# Altium schematic sheet Power+ICs.SchDoc
size 558 x 431 mm; SheetNumber: 1; SheetTotal: 1; ENG_APP_DATE: --/--/--; DSN_APP_DATE: --/--/--; CHK_APP_DATE: --/--/--
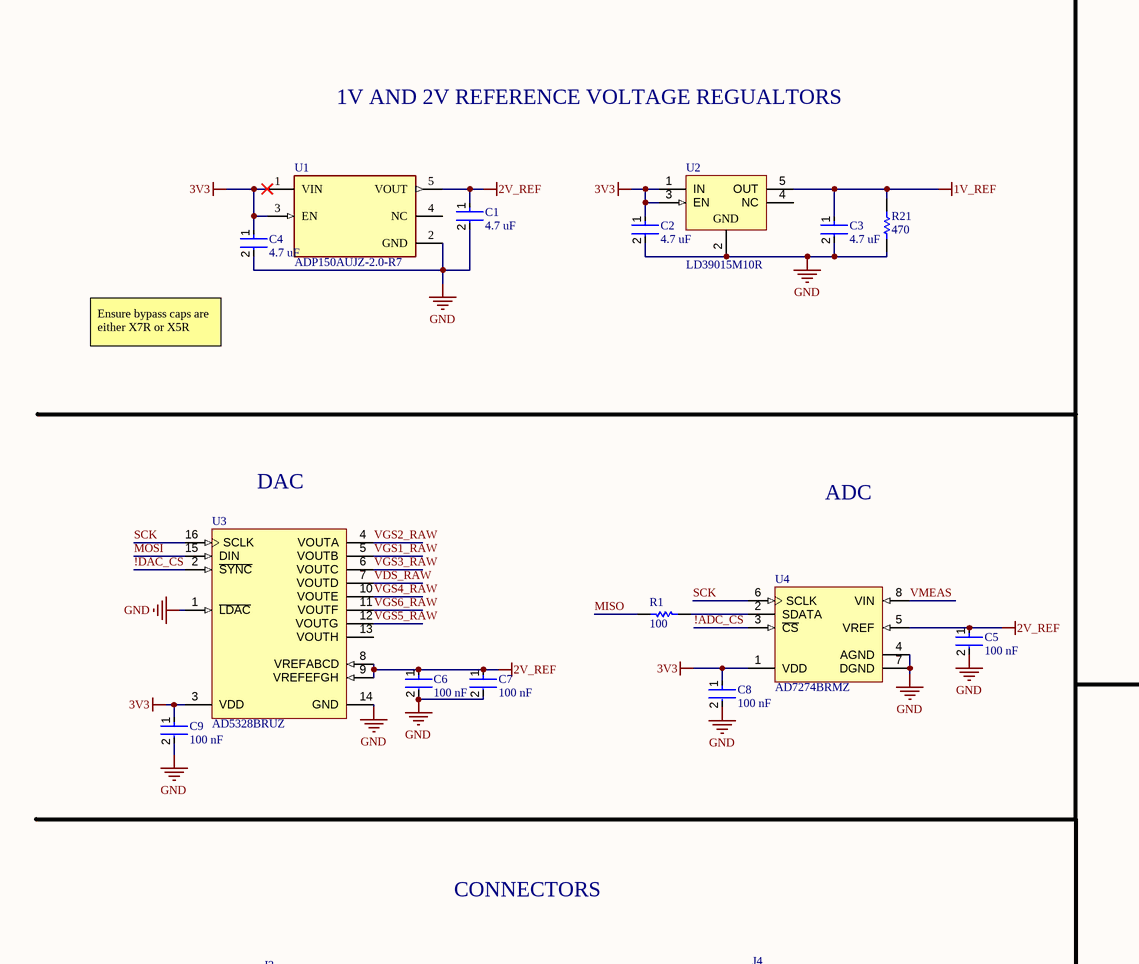
[diagram p0: Power+ICs.SchDoc, top left]
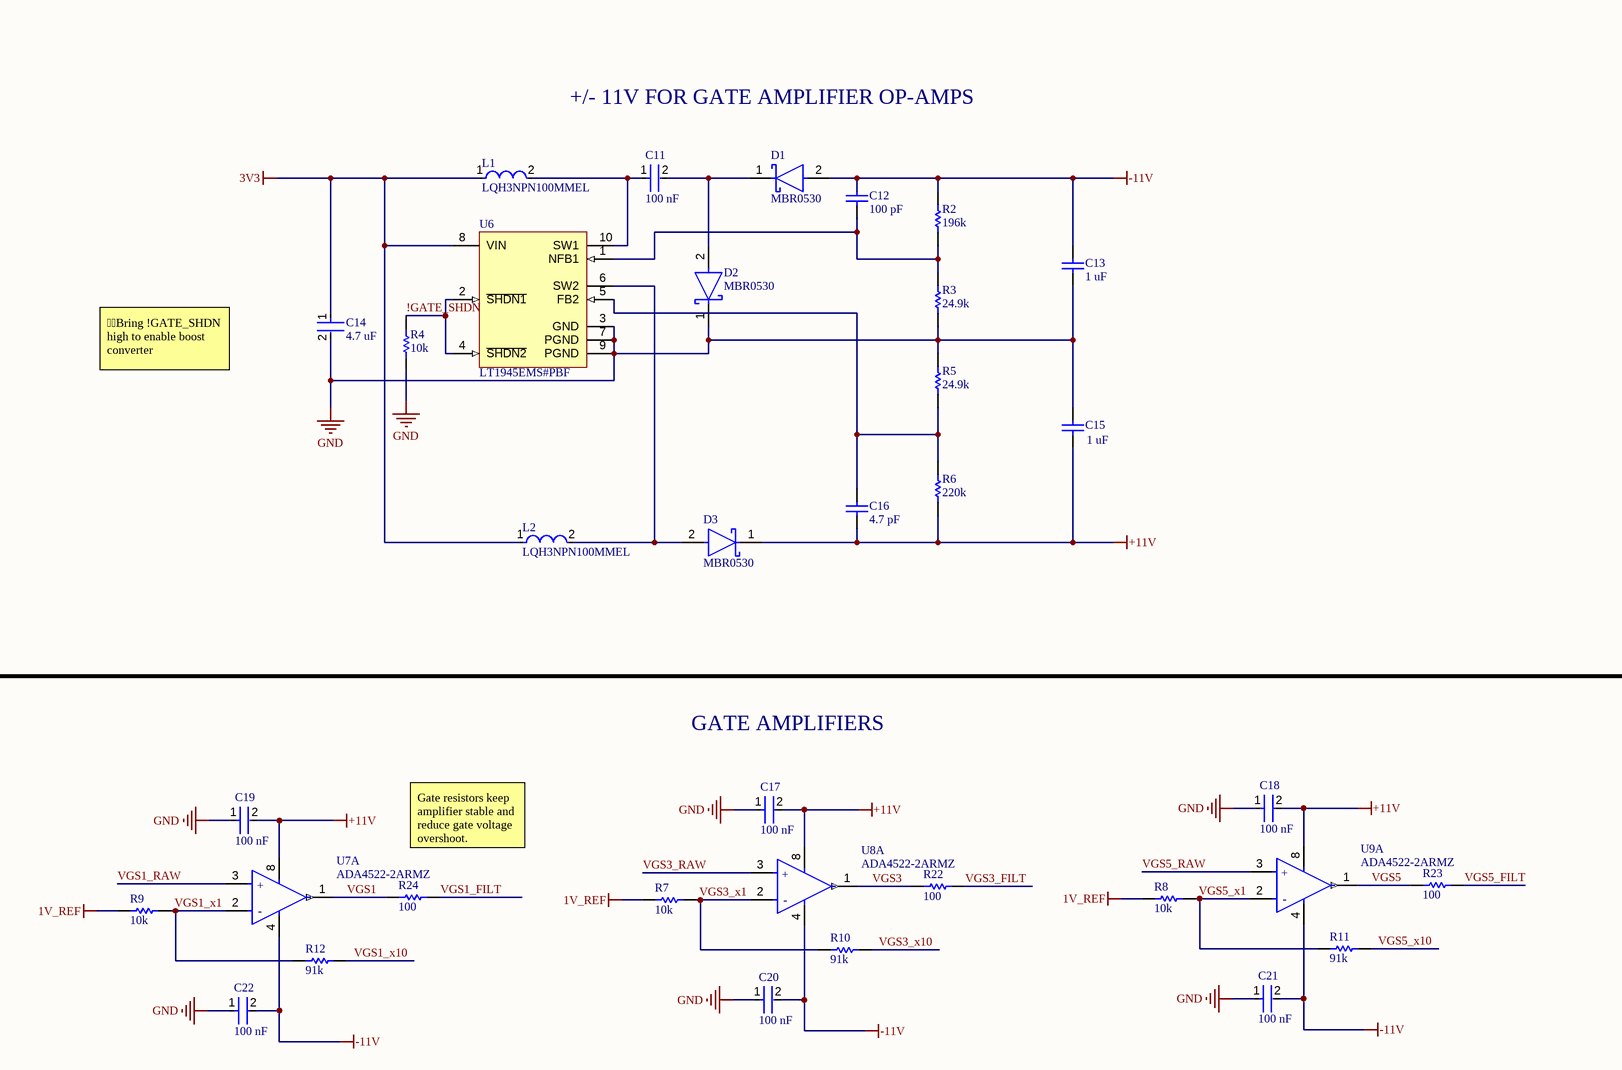
[diagram p1: Power+ICs.SchDoc, top right]
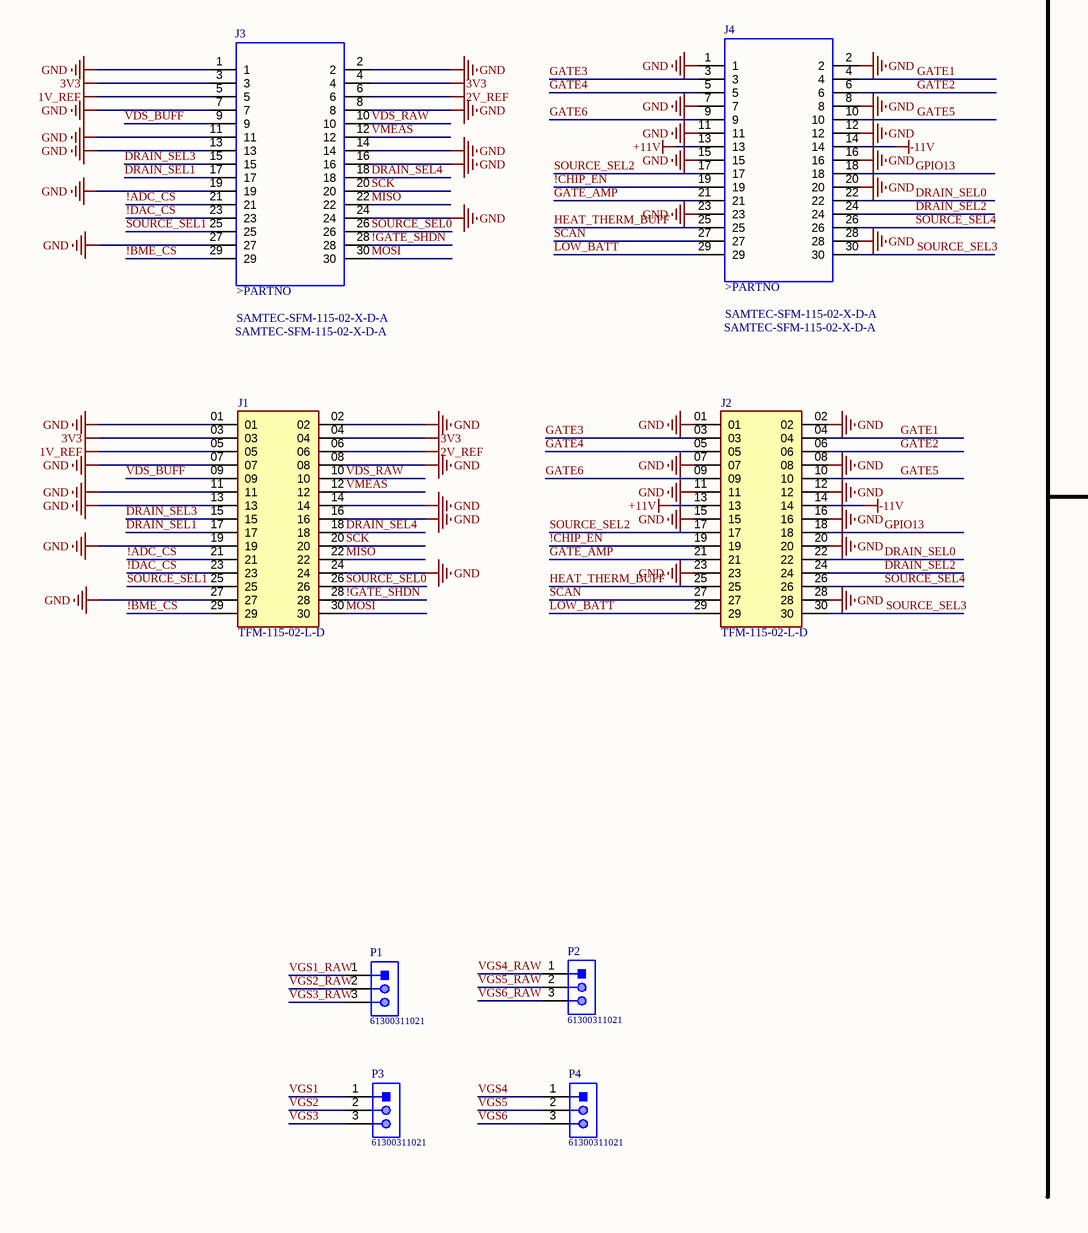
[diagram p2: Power+ICs.SchDoc, bottom left]
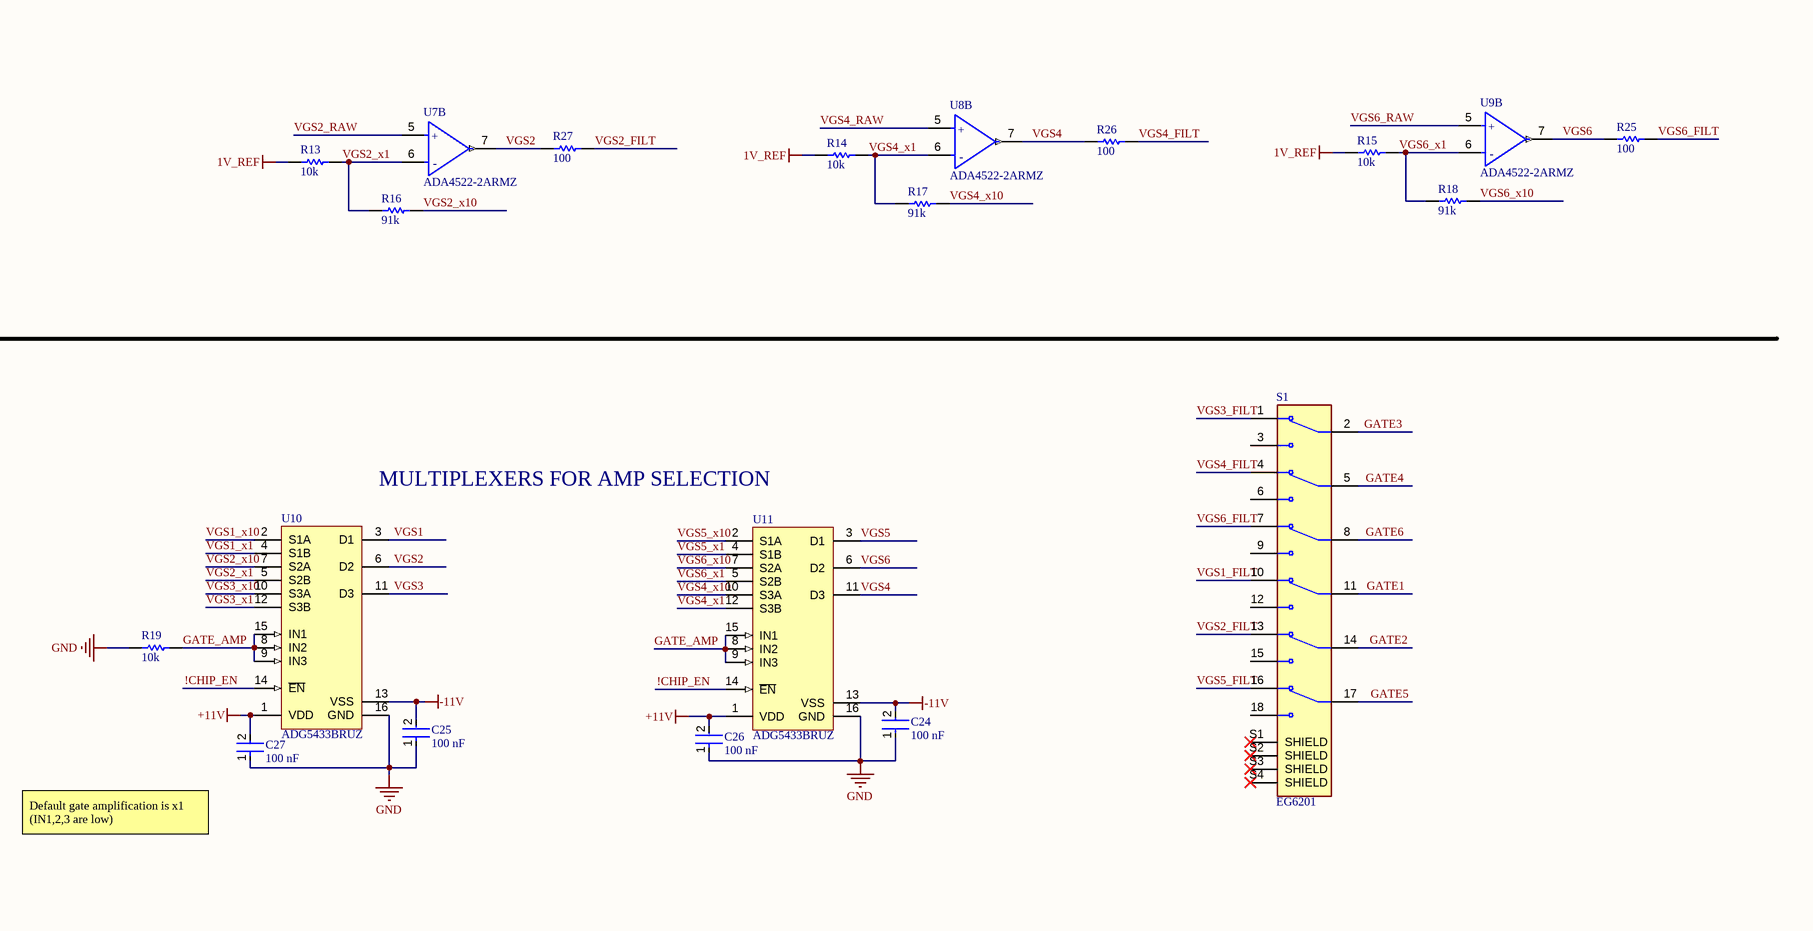
[diagram p3: Power+ICs.SchDoc, bottom right]

## Parts
C1  4.7 uF  [FP-C0805C475K3PACTU-MFG]
C2  4.7 uF  [FP-C0805C475K3PACTU-MFG]
C3  4.7 uF  [FP-C0805C475K3PACTU-MFG]
C4  4.7 uF  [FP-C0805C475K3PACTU-MFG]
C5  100 nF  [FP-C0805C-DN-MFG]
C6  100 nF  [FP-C0805C-DN-MFG]
C7  100 nF  [FP-C0805C-DN-MFG]
C8  100 nF  [FP-C0805C-DN-MFG]
C9  100 nF  [FP-C0805C-DN-MFG]
C11  100 nF  [FP-C0805C-DN-MFG]
C12  100 pF  [CAPC2013X140X50ML20T25]
C13  1 uF  [CAPC3216X110X50LL20T25]
C14  4.7 uF  [FP-C0805C475K3PACTU-MFG]
C15  1 uF  [CAPC3216X110X50LL20T25]
C16  4.7 pF  [CAPC2013X71X50ML20T25]
C17  100 nF  [FP-C0805C-DN-MFG]
C18  100 nF  [FP-C0805C-DN-MFG]
C19  100 nF  [FP-C0805C-DN-MFG]
C20  100 nF  [FP-C0805C-DN-MFG]
C21  100 nF  [FP-C0805C-DN-MFG]
C22  100 nF  [FP-C0805C-DN-MFG]
C24  100 nF  [FP-C0805C-DN-MFG]
C25  100 nF  [FP-C0805C-DN-MFG]
C26  100 nF  [FP-C0805C-DN-MFG]
C27  100 nF  [FP-C0805C-DN-MFG]
D1  MBR0530  [FP-425-04-MFG]
D2  MBR0530  [FP-425-04-MFG]
D3  MBR0530  [FP-425-04-MFG]
J1  TFM-115-02-L-D  [SAMTEC_TFM-115-02-L-D]
J2  TFM-115-02-L-D  [SAMTEC_TFM-115-02-L-D]
J3  SAMTEC-SFM-115-02-X-D-A  [SAMTEC-SFM-115-02-X-D-A]
J4  SAMTEC-SFM-115-02-X-D-A  [SAMTEC-SFM-115-02-X-D-A]
L1  LQH3NPN100MMEL  [FP-LQH3NPH_ME-MFG]
L2  LQH3NPN100MMEL  [FP-LQH3NPH_ME-MFG]
P1  61300311021  [61300311021]
P2  61300311021  [61300311021]
P3  61300311021  [61300311021]
P4  61300311021  [61300311021]
R1  100  [RESC2013X50X30LL20T20]
R2  196k  [RESC2013X50X30LL20T20]
R3  24.9k  [RESC2013X70X40LL20T20]
R4  10k  [RESC2013X60X35NL10T20]
R5  24.9k  [RESC2013X70X40LL20T20]
R6  220k  [RESC2013X70X40ML20T20]
R7  10k  [RESC2013X60X35NL10T20]
R8  10k  [RESC2013X60X35NL10T20]
R9  10k  [RESC2013X60X35NL10T20]
R10  91k  [RESC2013X60X35ML10T20]
R11  91k  [RESC2013X60X35ML10T20]
R12  91k  [RESC2013X60X35ML10T20]
R13  10k  [RESC2013X60X35NL10T20]
R14  10k  [RESC2013X60X35NL10T20]
R15  10k  [RESC2013X60X35NL10T20]
R16  91k  [RESC2013X60X35ML10T20]
R17  91k  [RESC2013X60X35ML10T20]
R18  91k  [RESC2013X60X35ML10T20]
R19  10k  [RESC2013X60X35NL10T20]
R21  470  [RESC2013X70X40ML20T20]
R22  100  [RESC2013X50X30LL20T20]
R23  100  [RESC2013X50X30LL20T20]
R24  100  [RESC2013X50X30LL20T20]
R25  100  [RESC2013X50X30LL20T20]
R26  100  [RESC2013X50X30LL20T20]
R27  100  [RESC2013X50X30LL20T20]
S1  EG6201  [SW_EG6201]
U1  ADP150AUJZ-2.0-R7  [FP-UJ-5-IPC_B]
U2  LD39015M10R  [SOT23-5L_M]
U3  AD5328BRUZ  [RU-16_L]
U4  AD7274BRMZ  [RM-8_N]
U6  LT1945EMS#PBF  [LT-MS-10_N]
U7  ADA4522-2ARMZ  [FP-RM-8-IPC_C]  (parts A,B of 2)
U8  ADA4522-2ARMZ  [FP-RM-8-IPC_C]  (parts A,B of 2)
U9  ADA4522-2ARMZ  [FP-RM-8-IPC_C]  (parts A,B of 2)
U10  ADG5433BRUZ  [ADI-RU-16_N]
U11  ADG5433BRUZ  [ADI-RU-16_N]

## Nets
1V_REF: C3.1 J1.05 J3.5 R7.2 R8.2 R9.2 R13.2 R14.2 R15.2 R21.2 U2.5(OUT)
2V_REF: C1.1 C5.1 C6.1 C7.1 J1.06 J3.6 U1.5(VOUT) U3.8(VREFABCD) U3.9(VREFEFGH) U4.5(VREF)
3V3: C2.1 C4.1 C8.1 C9.1 C14.1 J1.03 J1.04 J3.3 J3.4 L1.1 L2.1 U1.1(VIN) U1.3(EN) U2.1(IN) U2.3(EN) U3.3(VDD) U4.1(VDD) U6.8(VIN)
+11V: C15.1 C16.1 C17.2 C18.2 C19.2 C26.2 C27.2 D3.1(C) J2.13 J4.13 R6.1 U7.8(V+) U8.8(V+) U9.8(V+) U10.1(VDD) U11.1(VDD)
-11V: C12.1 C13.2 C20.2 C21.2 C22.2 C24.2 C25.2 D1.2(A) J2.14 J4.14 R2.2 U7.4(V-) U8.4(V-) U9.4(V-) U10.13(VSS) U11.13(VSS)
GND: C1.2 C2.2 C3.2 C4.2 C5.2 C6.2 C7.2 C8.2 C9.2 C13.1 C14.2 C15.2 C17.1 C18.1 C19.1 C20.1 C21.1 C22.1 C24.1 C25.1 C26.1 C27.1 D2.1(C) J1.01 J1.02 J1.07 J1.08 J1.11 J1.13 J1.14 J1.16 J1.19 J1.24 J1.27 J2.01 J2.02 J2.07 J2.08 J2.11 J2.12 J2.15 J2.16 J2.20 J2.23 J2.28 J3.1 J3.2 J3.7 J3.8 J3.11 J3.13 J3.14 J3.16 J3.19 J3.24 J3.27 J4.1 J4.2 J4.7 J4.8 J4.11 J4.12 J4.15 J4.16 J4.20 J4.23 J4.28 R3.1 R4.1 R5.2 R19.2 R21.1 U1.2(GND) U2.2(GND) U3.1(~{LDAC}) U3.14(GND) U4.4(AGND) U4.7(DGND) U6.3(GND) U6.7(PGND) U6.9(PGND) U10.16(GND) U11.16(GND)
!ADC_CS: J1.21 J3.21 U4.3(~{CS})
!BME_CS: J1.29 J3.29
!CHIP_EN: J2.19 J4.19 U10.14(~{EN}) U11.14(~{EN})
!DAC_CS: J1.23 J3.23 U3.2(~{SYNC})
!GATE_SHDN: J1.28 J3.28 R4.2 U6.2(~{SHDN1}) U6.4(~{SHDN2})
DRAIN_SEL0: J2.22 J4.22
DRAIN_SEL1: J1.17 J3.17
DRAIN_SEL2: J2.24 J4.24
DRAIN_SEL3: J1.15 J3.15
DRAIN_SEL4: J1.18 J3.18
GATE1: J2.04 J4.4 S1.11(COM4)
GATE2: J2.06 J4.6 S1.14(COM5)
GATE3: J2.03 J4.3 S1.2(COM1)
GATE4: J2.05 J4.5 S1.5(COM2)
GATE5: J2.10 J4.10 S1.17(COM6)
GATE6: J2.09 J4.9 S1.8(COM3)
GATE_AMP: J2.21 J4.21 R19.1 U10.8(IN2) U10.9(IN3) U10.15(IN1) U11.8(IN2) U11.9(IN3) U11.15(IN1)
GPIO13: J2.18 J4.18
HEAT_THERM_BUFF: J2.25 J4.25
LOW_BATT: J2.29 J4.29
MISO: J1.22 J3.22 R1.2
MOSI: J1.30 J3.30 U3.15(DIN)
SCAN: J2.27 J4.27
SCK: J1.20 J3.20 U3.16(SCLK) U4.6(SCLK)
SOURCE_SEL0: J1.26 J3.26
SOURCE_SEL1: J1.25 J3.25
SOURCE_SEL2: J2.17 J4.17
SOURCE_SEL3: J2.30 J4.30
SOURCE_SEL4: J2.26 J4.26
VDS_BUFF: J1.09 J3.9
VDS_RAW: J1.10 J3.10 U3.7(VOUTD)
VGS1: P3.1 R24.1 U7.1(OUT_A) U10.3(D1)
VGS1_FILT: R24.2 S1.10(NC4)
VGS1_RAW: P1.1 U3.5(VOUTB) U7.3(+IN_A)
VGS1_x1: R9.1 R12.1 U7.2(-IN_A) U10.4(S1B)
VGS1_x10: R12.2 U10.2(S1A)
VGS2: P3.2 R27.1 U7.7(OUT_B) U10.6(D2)
VGS2_FILT: R27.2 S1.13(NC5)
VGS2_RAW: P1.2 U3.4(VOUTA) U7.5(+IN_B)
VGS2_x1: R13.1 R16.1 U7.6(-IN_B) U10.5(S2B)
VGS2_x10: R16.2 U10.7(S2A)
VGS3: P3.3 R22.1 U8.1(OUT_A) U10.11(D3)
VGS3_FILT: R22.2 S1.1(NC1)
VGS3_RAW: P1.3 U3.6(VOUTC) U8.3(+IN_A)
VGS3_x1: R7.1 R10.1 U8.2(-IN_A) U10.12(S3B)
VGS3_x10: R10.2 U10.10(S3A)
VGS4: P4.1 R26.1 U8.7(OUT_B) U11.11(D3)
VGS4_FILT: R26.2 S1.4(NC2)
VGS4_RAW: P2.1 U3.10(VOUTE) U8.5(+IN_B)
VGS4_x1: R14.1 R17.1 U8.6(-IN_B) U11.12(S3B)
VGS4_x10: R17.2 U11.10(S3A)
VGS5: P4.2 R23.1 U9.1(OUT_A) U11.3(D1)
VGS5_FILT: R23.2 S1.16(NC6)
VGS5_RAW: P2.2 U3.12(VOUTG) U9.3(+IN_A)
VGS5_x1: R8.1 R11.1 U9.2(-IN_A) U11.4(S1B)
VGS5_x10: R11.2 U11.2(S1A)
VGS6: P4.3 R25.1 U9.7(OUT_B) U11.6(D2)
VGS6_FILT: R25.2 S1.7(NC3)
VGS6_RAW: P2.3 U3.11(VOUTF) U9.5(+IN_B)
VGS6_x1: R15.1 R18.1 U9.6(-IN_B) U11.5(S2B)
VGS6_x10: R18.2 U11.7(S2A)
VMEAS: J1.12 J3.12 U4.8(VIN)
NetC11_1: C11.1 L1.2 U6.10(SW1)
NetC11_2: C11.2 D1.1(C) D2.2(A)
NetC12_2: C12.2 R2.1 R3.2 U6.1(NFB1)
NetC16_2: C16.2 R5.1 R6.2 U6.5(FB2)
NetD3_2: D3.2(A) L2.2 U6.6(SW2)
NetR1_1: R1.1 U4.2(SDATA)

Not connected (* = marked no-connect by the designer): S1 3(NO1) 6(NO2) 9(NO3) 12(NO4) 15(NO5) 18(NO6) S1(SHIELD)* S2(SHIELD)* S3(SHIELD)* S4(SHIELD)*; U1 4(NC); U2 4(NC); U3 13(VOUTH)

## Notes on the sheet
- 1V AND 2V REFERENCE VOLTAGE REGUALTORS
- +/- 11V FOR GATE AMPLIFIER OP-AMPS
- Ensure bypass caps are either X7R or X5R
- Bring !GATE_SHDN high to enable boost converter
- (near U3) DAC
- ADC
- GATE AMPLIFIERS
- CONNECTORS
- (near R24) Gate resistors keep amplifier stable and reduce gate voltage overshoot.
- MULTIPLEXERS FOR AMP SELECTION
- Default gate amplification is x1 (IN1,2,3 are low)
- DWG. NO.
- REV.
- SHT.
- REVISION
- DESCRIPTION
- DATE
- APPROVED
- THIS DOCUMENT AND THE DATA DISCLOSED HEREIN OR HEREWITH IS THE PROPERTY OF ALTIUM LIMITED AND MAY BE FREELY DISTRIBUTED IN WHOLE. NO RIGHTS ARE RESERVED OR EXPRESS OR IMPLIED WARANTEE GIVEN.
- ENG:
- DSN:
- APPROVALS
- PROJECT
- DOCUMENT REVISION:
- DESIGN ITEM:
- CHK:
- BOM:
- REFERENCE DOCUMENTS
- PROJECT REVISION:
- TITLE
- FAB DWG:
- PCB DWG:
- ASSY DWG:
- SCALE:
- SIZE
- C
- CAGE CODE
- FILE NAME
- DWG NO.
- SHEET
- OF
- REV
- (in symbol CMP-09116-000003-2, part A) +; -
- (in symbol CMP-09116-000003-2, part B) +; -
- (in symbol SAMTEC-SFM-115-02-X-D-A) >PARTNO

## Library data of the parts
C1-C4 C14 = CMP-2007-01010-2: CAP CER 4.7UF 25V X5R 0805; Tolerance: 10%; Dielectric Material: Ceramic; Dissipation Factor: 5%; Length: 2mm; Number of Pins: 2; Voltage Rating (DC): 25V; Depth: 1.25mm; Min Operating Temperature: -55°C; Capacitance: 4.7uF; Series: C0805C; Lead Free: Lead Free; Dielectric: X5R; REACH SVHC: No SVHC; Termination: SMD/SMT; Mount: PCB; Package Quantity: 2500; Contact Plating: Tin; Case Code (Imperial): 0805; Max Operating Temperature: 85°C; Width: 1.2mm; Voltage: 25V; Case/Package: 0805; Packaging: Tape and Reel; Height: 1.25mm; RoHS Compliant: Yes; Construction: Flat; Case Code (Metric): 2012; Radiation Hardening: No
C5-C9 C11 C17-C22 C24-C27 = CMP-2007-00279-2: CAP CER 0.1UF 50V X7R 0805; Manufacturer Part Number: C0805C104K5RACTU; Manufacturer: KEMET; Value: 0.10 μF; Tolerance: 0.1; Temperature Coefficient: 30ppm/°C; Material: Ceramic; Device Class L2: Capacitors; Temperature Range Low: -55°C; Voltage Rating: 50 V; Digikey Description: CAP CER 0.1UF 50V X7R 0805; Category: Cap; ComponentLink2Description: Datasheet; Octopart: https://octopart.com/c0805c104k5ractu-kemet-143926; RoHS: TRUE; ComponentLink2URL: https://content.kemet.com/datasheets/KEM_C1003_C0G_SMD.pdf; Temperature Characteristic: X7R; Temperature: -55°C to +125°C; Height: 0.88mm; Temperature Range High: +125°C; Device Class L1: Passive Components; Automotive: No; Lead Free: Yes; Ipc Land Pattern Name: CAPC200125X78; Device Class L3: Ceramic Capacitors; Mouser Description: Cap Ceramic 0.1uF 50V X7R 10% SMD 2.0 x 1.2 mm 125 C Paper T/R; Capacitance: 0.10 μF; Package: C0805C-DN
C12 = CMP-2007-04713-1: 08055C101KAT2A; Manufacturer: AVX Interconnect / Elco; Part Number: 08055C101KAT2A
C13 C15 = CMP-2000-06011-1: C1206C105K5RACTU; Manufacturer: Kemet; Case Height: 1mm; Dielectric: X7R; Voltage Rating: 50V; Capacitance: 1uF; Temperature Coefficient / Code: +/-15%; Case Length: 3.2mm; Case Width: 1.6mm; Type: SMDMLCCX7R6.3-250VDCCommericalGrade; Tolerance: 10%; Class: Class1; Capacitance - nF: 1000nF; Datasheet URL: http://www.kemet.com/docfinder?Partnumber=C1206C105K5RACTU; Product Category: MultilayerCeramicCapacitorsMLCC-SMD/SMT; Termination Style: SMD/SMT; Dimensions: 1.6mmWx3.2mmLx1mmH; Voltage Rating DC: 50V; Datasheet Version: 02/2016; Packaging: Reel; Brand: Kemet; RoHS: Details; Minimum Operating Temperature: -55C; Operating Temperature Range: -55Cto+125C; Package Reference: 1206; Manufacturer URL: http://www.kemet.com/; Product: GeneralTypeMLCCs; Package Description: 2-Pin Surface Mount Device, Body 3.2 x 1.6 mm; Mounting Technology: SurfaceMount; Case Code - mm: 3216; Maximum Operating Temperature: +125C; Series: C1206C; Factory Pack Quantity: 2500; Package / Case: 1206(3216metric); Case Code - in: 1206
C16 = CMP-1036-00549-2: 08055A4R7CAT2A; Manufacturer: AVX Interconnect / Elco; Part Number: 08055A4R7CAT2A
D1-D3 = CMP-2000-05113-2: DIODE SCHOTTKY 30V 500MA SOD123; Polarity: Standard; Max Reverse Leakage Current: 130uA; Forward Voltage: 430mV; Element Configuration: Single; Peak Non-Repetitive Surge Current: 5.5A; REACH SVHC: No SVHC; Contact Plating: Tin; Width: 1.6mm; Weight: 0.03g; Max Reverse Voltage (DC): 30V; Mount: Surface Mount; Max Repetitive Reverse Voltage (Vrrm): 30V; Number of Pins: 2; Height: 1.03mm; Current Rating: 500mA; Max Forward Surge Current (Ifsm): 5.5A; Lead Free: Lead Free; Max Surge Current: 5.5A; Peak Reverse Current: 130uA; Min Operating Temperature: -65°C; Radiation Hardening: No; Max Operating Temperature: 150°C; Average Rectified Current: 500mA; Packaging: Tape and Reel; Length: 2.7mm; Forward Current: 500mA; Voltage Rating (DC): 30V; Package Quantity: 1; Output Current: 500mA
J1 J2 = TFM-115-02-L-D: MF: Samtec Inc.; System: Connector; Availability: Unavailable; Price: None; Package: None; MP: TFM-115-02-L-D; Parameter 1: *
J3 J4 = SAMTEC-SFM-115-02-X-D-A: System: Connector; MF: Samtec Inc.; MP: SAMTEC-SFM-115-02-X-D-A; Package: None; Price: None; Availability: Unavailable; Parameter 1: *
L1 L2 = CMP-06042-002074-1: Wire Wound Ferrite Inductor for Power Lines 10μH ±20% 0.228Ω 1280mA 1212; Current Rating: 1.28A; DC Resistance (DCR): 228mR; Inductance: 10uH; Saturation Current: 810mA; Self Resonant Frequency: 20MHz; Shielding: Shielded; Test Frequency: 1MHz; Core Material: Ferrite; Resistor Type: Wirewound; Case/Package: 1212; Min Operating Temperature: -40°C; Packaging: Tape and Reel; Max Operating Temperature: 85°C; Tolerance: 20%; Case Code (Imperial): 1212; Case Code (Metric): 3030; Mount: Surface Mount
P1-P4 = CMP-1502-01061-1: THT Angled Pin Header WR-PHD, Pitch 2.54 mm, Single Row, 3 pins; Manufacturer: Wurth Elektronik; Pitch: 2.54mm; Contact Resistance: 20mOhm; Gender: Male; Pin Number: 3; Rated Current: 3A; Working Voltage: 250VAC; Withstanding Voltage: 500VAC; Package Reference: 61300311021; Manufacturer URL: http://www.we-online.de; Datasheet URL: https://katalog.we-online.de/em/datasheet/6130xx11021.pdf; Row Number: Single; Operating Temperature: -40to105degC; Publisher: WurthElektronik; Orientation: Angled; Mounting Technology: THT; Part Number: 61300311021; Packaging: Bag
R1 R22-R27 = CMP-2001-04901-1: Manufacturer: Vishay Dale; Part Number: CRCW0805100RFKEA
R2 = CMP-2001-04310-1: Manufacturer: Vishay Dale; Part Number: CRCW0805196KFKEA
R3 R5 = CMP-2001-00073-1: Part Number: ERJ-6ENF2492V; Manufacturer: Panasonic
R4 R7-R9 R13-R15 R19 = CMP-1659-00013-4: Chip Resistor, 10 KOhm, +/- 1%, 0.125 W, -55 to 155 degC, 0805 (2012 Metric), RoHS, Tape and Reel; Manufacturer: Yageo; Voltage Rating: 150 V; Mount: Surface Mount; ComponentLink1Description: Manufacturer URL; ComponentLink2URL: http://www.yageo.com/documents/recent/PYu-RC_Group_51_RoHS_L_04.pdf; Pins: 2; Length: 2 mm; Min Operating Temperature: -55 degC; Height: 0.5 mm; Mounting Technology: Surface Mount; RoHSCompliant: true; REACH SVHC: No SVHC; ComponentLink1URL: http://www.yageo.com/; Max Operating Temperature: 155 degC; PackageReference: 0805; DatasheetVersion: Rev. 4, 02/2016; Package Quantity: 5000; Packaging: Tape and Reel; ComponentLink2Description: Datasheet; PackageDescription: 2-Pin Surface Mounted Device, Body 2 x 1.25 mm
R6 = CMP-2001-00522-1: Part Number: ERJ6ENF2203V; Manufacturer: Panasonic
R10-R12 R16-R18 = CMP-2001-01407-1: Part Number: RC0805JR-0791KL; Manufacturer: Yageo
R21 = CMP-2001-00549-5: Chip Resistor, 470 Ohm, +/- 1%, 0.125 W, -55 to 155 degC, 0805 (2012 Metric), RoHS, Tape and Reel; Manufacturer: Panasonic; Voltage Rating: 150 V; ComponentLink1URL: http://www.panasonic.com/; ComponentLink2Description: Datasheet; RoHSCompliant: true; PackageDescription: 2-Pin Surface Mount Device, Body 2 x 1.25 mm; PackageReference: 0805; REACH SVHC: Yes; Max Operating Temperature: 155 degC; Mount: Surface Mount; Min Operating Temperature: -55 degC; DatasheetVersion: 04/2015; Mounting Technology: Surface Mount; Height: 0.6 mm; Package Quantity: 1; ComponentLink2URL: http://industrial.panasonic.com/cdbs/www-data/pdf/RDA0000/AOA0000C86.pdf; Length: 2 mm; ComponentLink1Description: Manufacturer URL; Pins: 2; Packaging: Cut Tape
S1 = EG6201: Slide Switch 6PDT Through Hole, Right Angle; MF: E-Switch; Value: *; Availability: Unavailable; Package: None; SnapEDA_Link: https://www.snapeda.com/parts/EG6201/E-Switch/view-part/550164/?ref=snap; Price: None; MP: EG6201
U1 = CMP-09138-000207-1: IC REG LINEAR 2V 150MA 5TSOT; Dropout Voltage: 105mV; Output Configuration: Positive; Max Input Voltage: 5.5V; Max Supply Current: 320uA; Output Type: Fixed; Min Current Limit: 190mA; Accuracy: 1%; Operating Supply Current: 10uA; Number of Regulators: 1; Quiescent Current: 22uA; Power Supply Rejection Ratio (PSRR): 70dB; Min Input Voltage: 2.2V; Max Operating Temperature: 125°C; Series: -; Min Output Voltage: 2V; Case/Package: SOT-23-5; Packaging: Cut Tape; RoHS Compliant: Yes; Polarity: Positive; Max Output Current: 150mA; Mount: Surface Mount; Number of Pins: 5; Output Voltage: 2V; Contact Plating: Tin; Min Operating Temperature: -40°C; Number of Outputs: 1; Lead Free: Contains Lead; Output Current: 150mA
U2 = CMP-0244-00345-1: 150 mA Low Quiescent Current Low Noise Voltage Regulator, 1.0V, 5-Pin SOT-23, Tape and Reel; ComponentLink2URL: http://www.st.com/internet/com/TECHNICAL_RESOURCES/TECHNICAL_LITERATURE/DATASHEET/CD00173477.pdf; ComponentLink1Description: Manufacturer URL; DatasheetVersion: 1/02/2009; ComponentLink1URL: http://www.st.com; ComponentLink2Description: Datasheet; PackageReference: SOT23-5L; PackageVersion: 1/01/2008; PackageDescription: 5-Pin SOT-23 Package, 2.9 x 1.6 mm Body, 0.95 mm Pitch, 2.8 mm Lead Span
U3 = CMP-0318-02011-2: Octal 12-Bit Voltage Output Digital-to-Analog Converter, 2.5 to 5.5 V, -40 to +125 degC, RU-16, Pb-Free, Tube; Generic Part Number: AD5328; Manufacturer: Analog Devices; Settling Time: 6Âµs; Op Pwr Diss: 5mW; Max V+: 5.5V; Single Supply: Yes; Resolution (Bits): 12; # DAC Outputs: 8; PackageDescription: 16-Lead Thin Shrink Small Outline Package [TSSOP]; ComponentLink3URL: http://www.analog.com/static/imported-files/packages/36244347913743854010197452789RU16.pdf; DatasheetVersion: Rev.F; ComponentLink2Description: Datasheet; Mounting Technology: Surface Mount; ComponentLink4URL: http://www.analog.com/en/digital-to-analog-converters/da-converters/ad5328/products/product.html; RevisionNote: Component URL fixed; PackageVersion: Nov-2002; PackageReference: RU-16; ComponentLink1URL: http://www.analog.com/en/index.html; ComponentLink4Description: Product URL; ComponentLink1Description: Manufacturer URL; Packing: Tube; ComponentLink2URL: http://www.analog.com/static/imported-files/data_sheets/AD5308_5318_5328.pdf; RoHS: Y; ComponentLink3Description: Package Specification; Code_JEDEC: MO-153-AB; PartNumber: AD5328BRUZ
U4 = CMP-0313-01921-2: Single 12-Bit Analog-to-Digital Converter with Serial, SPI Interface, 3MSPS, -40 to +125 degC, RM-8, Pb-Free, Tube; Generic Part Number: AD7274; Manufacturer: Analog Devices; Throughput Rate (SPS): 3M; Channels: 1; Interface: Ser, SPI; Resolution (Bits): 12; DatasheetVersion: Rev.0; ComponentLink2Description: Datasheet; ComponentLink3Description: Package Specification; RoHS: Y; PartNumber: AD7274BRMZ; ComponentLink4URL: http://www.analog.com/en/analog-to-digital-converters/ad-converters/ad7274/products/product.html; PackageVersion: Aug-2005; PackageDescription: 8-Lead Mini Small Outline Package [MSOP]; Mounting Technology: Surface Mount; Packing: Tube; ComponentLink1URL: http://www.analog.com/en/index.html; ComponentLink2URL: http://www.analog.com/static/imported-files/data_sheets/AD7273_7274.pdf; ComponentLink1Description: Manufacturer URL; ComponentLink3URL: http://www.analog.com/static/imported-files/packages/PKG_PDF/MSOP%28RM%29/RM_8.pdf; Code_JEDEC: MO-187-AA; ComponentLink4Description: Product URL; PackageReference: RM-8
U6 = CMP-0478-00153-1: Dual Micropower DC/DC Converter with Positive and Negative Outputs, 1.2 to 15 V Vin, 10-pin SOP (MS-10), -40 to 85 degC, Pb-Free; Manufacturer: Linear Technology; Number of Outputs: 2; Vin Max(V): 15; Vin Min(V): 1.2; ComponentLink3Description: Package Specification; RoHS: TRUE; ComponentLink1Description: Manufacturer URL; ComponentLink2URL: http://cds.linear.com/docs/en/datasheet/1945fa.pdf; PartNumber: LT1945EMS#PBF; Mounting Technology: Surface Mount; PackageVersion: Rev. E, 06/2010; ComponentLink1URL: http://www.linear.com/; DatasheetVersion: Rev. A; PackageReference: MS-10; ComponentLink2Description: Datasheet; PackageDescription: 10-Pin Plastic MSOP, Body 3 x 3 mm, Pitch 0.5 mm; ComponentLink3URL: http://cds.linear.com/docs/en/packaging/05081661_F_MS.pdf
U7-U9 = CMP-09116-000003-2: IC OPAMP ZERO-DRIFT 2 CIRC 8MSOP; Max Dual Supply Voltage: 27.5V; Power Supply Rejection Ratio (PSRR): 150dB; Operating Supply Current: 830uA; Max Supply Voltage: 55V; Min Dual Supply Voltage: 2.25V; Input Bias Current: 50pA; Gain Bandwidth Product: 2.7MHz; Voltage Gain: 137dB; Common Mode Rejection Ratio: 140dB; Slew Rate: 1.7V/µs; Input Offset Voltage (Vos): 1.5uV; Output Current per Channel: 32mA; Min Supply Voltage: 4.5V; Packaging: Rail/Tube; Max Operating Temperature: 125°C; Min Operating Temperature: -40°C; Mount: Surface Mount; Number of Pins: 8; Case/Package: MSOP; Lead Free: Contains Lead
U10 U11 = CMP-0794-00021-1: High Voltage Latch-Up Proof, Triple SPDT Switches, 12.5 Ohm Ron, 16-pin SOP (RU-16), Tube; Manufacturer: Analog Devices; Ron (ohms): 13.5, 12.5, 26, 14.5; Max Pos Supply: +40V; Max Neg Supply: -22V; # Sw Functions: 3; t ON: 160ns, 152ns, 228ns, 176ns; ComponentLink1URL: http://www.analog.com/en/index.html; Code_JEDEC: MO-153AB; PackageReference: RU-16; DatasheetVersion: Rev. B; PackageDescription: 16-Pin Thin Shrink Small Outline Package, Body 5 x 4.4 mm, Pitch 0.65 mm; PartNumber: ADG5433BRUZ; ComponentLink2Description: Datasheet; ComponentLink2URL: http://www.analog.com/static/imported-files/data_sheets/ADG5433_5434.pdf; Mounting Technology: Surface Mount; ComponentLink3URL: http:/www.analog.com/static/imported-files/packages/36244347913743854010197452789RU16.pdf; ComponentLink1Description: Manufacturer URL; ComponentLink3Description: Package Specification; Configuration: SPDT; Packing: Tube; PackageVersion: Nov-02